# Altium schematic sheet ETH_on_RS485_Node_Example_RS485.SchDoc: RS485 Interface
size A3; DrawnBy: Nico Korn; Engineer: Nico Korn; Organization: Reichle & De-Massari; Address1: Binzstrasse 32; Address2: 8620 Wetzikon; Address3: Switzerland; DocumentNumber: 5; Revision: V1.0; SheetNumber: 5; SheetTotal: 7; Description1: Beschreibung; Size: A3; ShortDescription: RS485
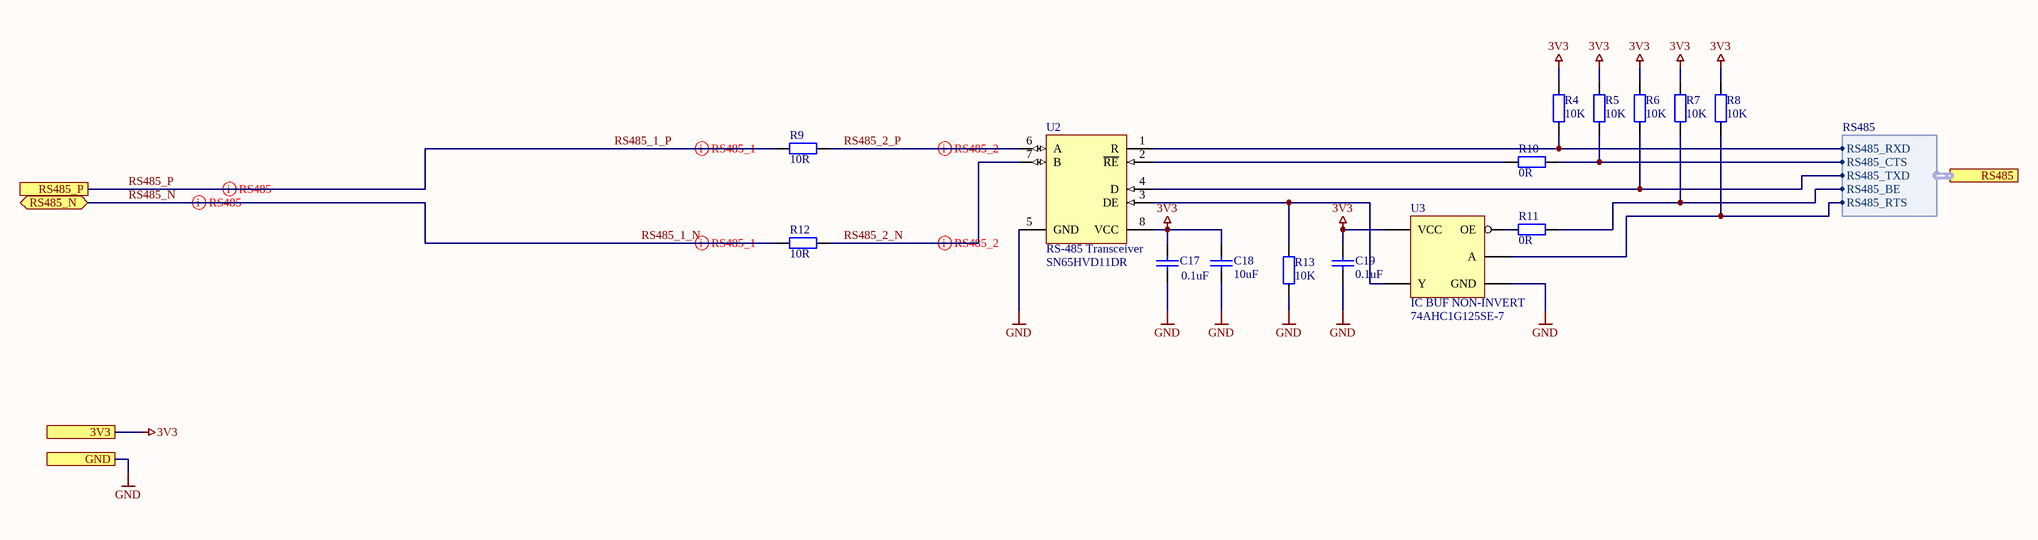
[diagram p0: ETH_on_RS485_Node_Example_RS485.SchDoc]

## Parts
C17  0.1uF  [Ceramic Capacitor 0402 EIA]
C18  10uF  [Ceramic Capacitor 0603 EIA]
C19  0.1uF  [Ceramic Capacitor 0402 EIA]
R4  10K  [Resistor 0402 EIA]
R5  10K  [Resistor 0402 EIA]
R6  10K  [Resistor 0402 EIA]
R7  10K  [Resistor 0402 EIA]
R8  10K  [Resistor 0402 EIA]
R9  10R  [Resistor 0603 EIA]
R10  0R  [Resistor 0402 EIA]
R11  0R  [Resistor 0402 EIA]
R12  10R  [Resistor 0603 EIA]
R13  10K  [Resistor 0402 EIA]
U2  RS-485 Transceiver  [TI_D (R-PDSO-G8)_8_R]
U3  IC BUF NON-INVERT  [SOT353]

## Ports
3V3, GND, RS485 (harness RS485), RS485_N (bidir), RS485_P

## Harnesses
RS485: RS485_RXD, RS485_CTS, RS485_TXD, RS485_BE, RS485_RTS

## Nets
3V3: C17.1 C18.2 C19.1 R4.2 R5.2 R6.2 R7.2 R8.2 U2.8(VCC) U3.5(VCC) ; port 3V3
GND: C17.2 C18.1 C19.2 R13.1 U2.5(GND) U3.3(GND) ; port GND
RS485_1_N: R12.1 ; port RS485_N  [also labelled RS485_N]
RS485_1_P: R9.1 ; port RS485_P  [also labelled RS485_P]
RS485_2_N: R12.2 U2.7(B)
RS485_2_P: R9.2 U2.6(A)
NetR4_1: R4.1 U2.1(R) ; port RS485.RS485_RXD
NetR5_1: R5.1 R10.2 ; port RS485.RS485_CTS
NetR6_1: R6.1 U2.4(D) ; port RS485.RS485_TXD
NetR7_1: R7.1 R11.2 ; port RS485.RS485_BE
NetR8_1: R8.1 U3.2(A) ; port RS485.RS485_RTS
NetR10_1: R10.1 U2.2(~{RE})
NetR11_1: R11.1 U3.1(OE)
NetR13_2: R13.2 U2.3(DE) U3.4(Y)

## Layout directives
differential pair: RS485_1_N, RS485_1_P, RS485_2_N, RS485_2_P

## Notes on the sheet
- Title
- Size:
- Date:
- A3
- Number:
- Time:
- Revision:
- Sheet
- of
- File:

## Library data of the parts
C17 C19 = Cap_0.1uF_0402: SMD/SMT WCAP-CSGP 0.1uF 0402 20% 10V MLCC; Manufacturer: Wurth Electronics; Manufacturer PartNr: 885012105010; voltage: 10VDC; Dielectric Grade: X5R; Replaceable: yes; value: 0.1uF; tolerance: 20%; ComponentLink1Description: mouser; ComponentLink1URL: https://www.mouser.ch/ProductDetail/Wurth-Electronics/885012105010?qs=sGAEpiMZZMs0AnBnWHyRQEGbLOF2VP1ihL84oCjXnlO407YOHi%2fQbw%3d%3d; Footprint/Package: 0402; Supplier 1: Mouser; Supplier 2: Farnell; Supplier 3: Digi-Key; Supplier Part Number 1: 710-885012105010; Supplier Part Number 2: 2533928; Supplier Part Number 3: 732-7487-1-ND
C18 = Cap_10uF_0603: SMD/SMT 0603 10uF 10volts; Manufacturer: Murata; Manufacturer PartNr: GRM188D71A106MA73D; tolerance: 20%; voltage: 10VDC; Replaceable: yes; Dielectric Grade: X5R; value: 10uF; Footprint/Package: 0603
R4-R8 R13 = Res_10K_0402: SMD 10K ohm 1% 50V General Purpose; Manufacturer: Yageo; Manufacturer PartNr: RC0402FR-1010KL; power: 63mW; Replaceable: yes; value: 10K; tolerance: 1%; ComponentLink1Description: mouser; ComponentLink1URL: https://www.mouser.ch/ProductDetail/Yageo/RC0402FR-1010KL?qs=sGAEpiMZZMtlubZbdhIBIEgN9MQql2m6Sb2LnYlCICU%3d; Footprint/Package: 0402; Supplier 1: Mouser; Supplier Part Number 1: 603-RC0402FR-1010KL
R9 R12 = Res_10R_0603: SMD 0603 10ohms 1%; Manufacturer: Vishay; Manufacturer PartNr: CRCW060310R0FKEAHP; power: 250mW; Replaceable: yes; value: 10R; tolerance: 1%; Footprint/Package: 0603
R10 R11 = Res_0R_0402: 0 Ohms Resistor 0402; Manufacturer: Panasonic Electronic Components; Manufacturer PartNr: ERJ-2GE0R00X; power: 100mW; Replaceable: yes; value: 0R; tolerance: -; Footprint/Package: 0402
U2 = SN65HVD11DR: RS-485 Interface IC 3.3V Differential Transceivers; Manufacturer: Texas Instruments; Replaceable: no; Manufacturer PartNr: SN65HVD11DR; ComponentLink1Description: mouser; ComponentLink1URL: https://www.mouser.ch/ProductDetail/Texas-Instruments/SN65HVD11DR?qs=sGAEpiMZZMtk5jbcouIbS2cUqarwnJ3LOIItPoxnG4E%3d; Footprint/Package: SOIC-8; Supplier 1: Digi-Key; Supplier 2: Farnell; Supplier 3: Mouser; Supplier Part Number 1: 296-31717-6-ND; Supplier Part Number 2: 2436743; Supplier Part Number 3: 595-SN65HVD11DR
U3 = 74AHC1G125SE-7: Buffer, Non-Inverting 1 Element 1 Bit per Element 3-State Output SOT-353; Manufacturer: Diodes Incorporated; Replaceable: no; Footprint/Package: SOT353; ComponentLink1Description: mouser; ComponentLink1URL: https://www.mouser.ch/ProductDetail/Samtec/BBL-103-G-E?qs=sGAEpiMZZMs%252bGHln7q6pm5ZHNJhTjtr3eyJKd0ZImQM%3d; Supplier 2: Mouser; Supplier 1: Digi-Key; Supplier 3: Farnell; Supplier Part Number 1: SAM1104-03-ND; Supplier Part Number 2: 200-SL103G12; Supplier Part Number 3: 2019491; Manufacturer PartNr: 74AHC1G125SE-7